# EAGLE design 上昇＆摘果機構回路 (EAGLE 9.6.2)
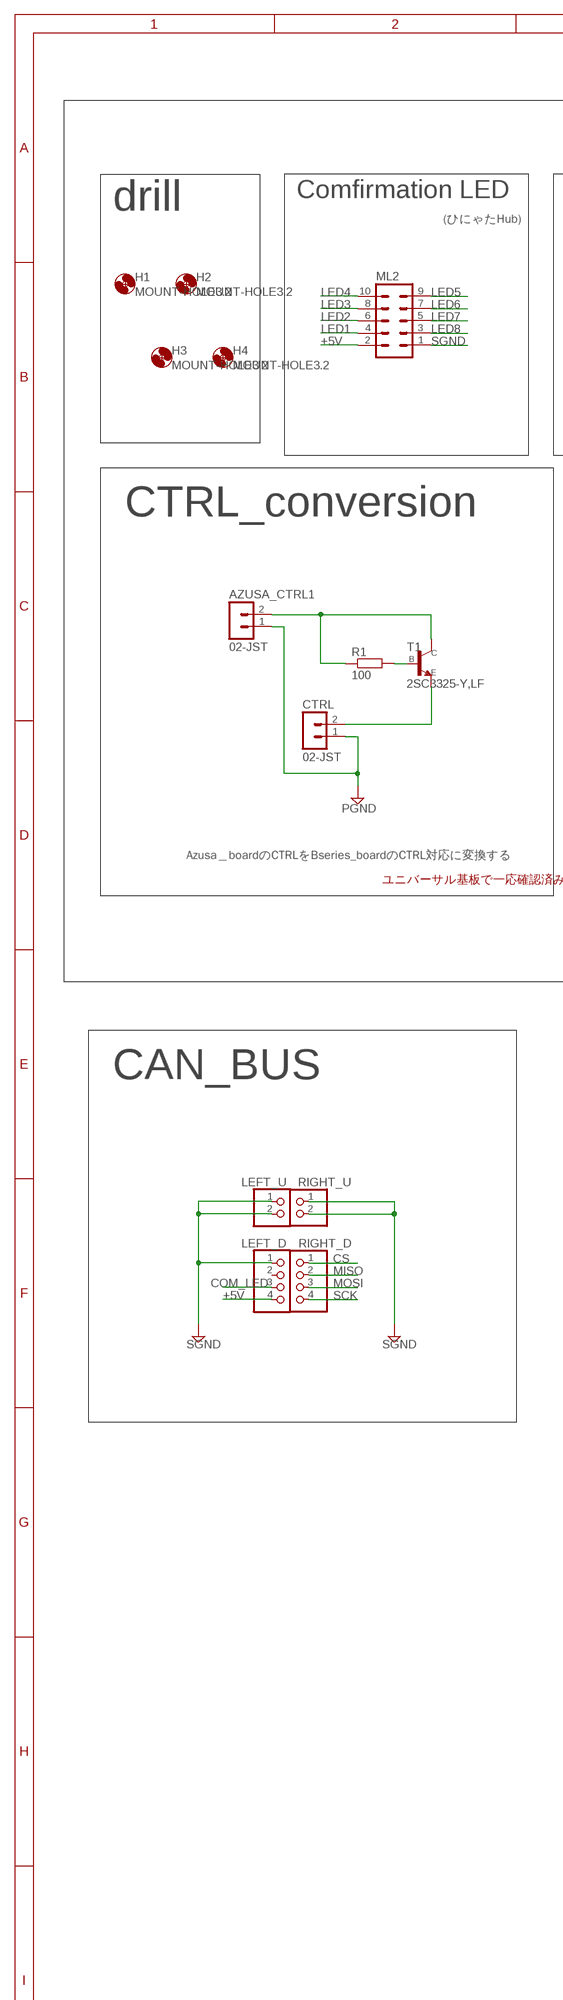
[diagram p0: schematic, sheet 1, part 1 of 2]
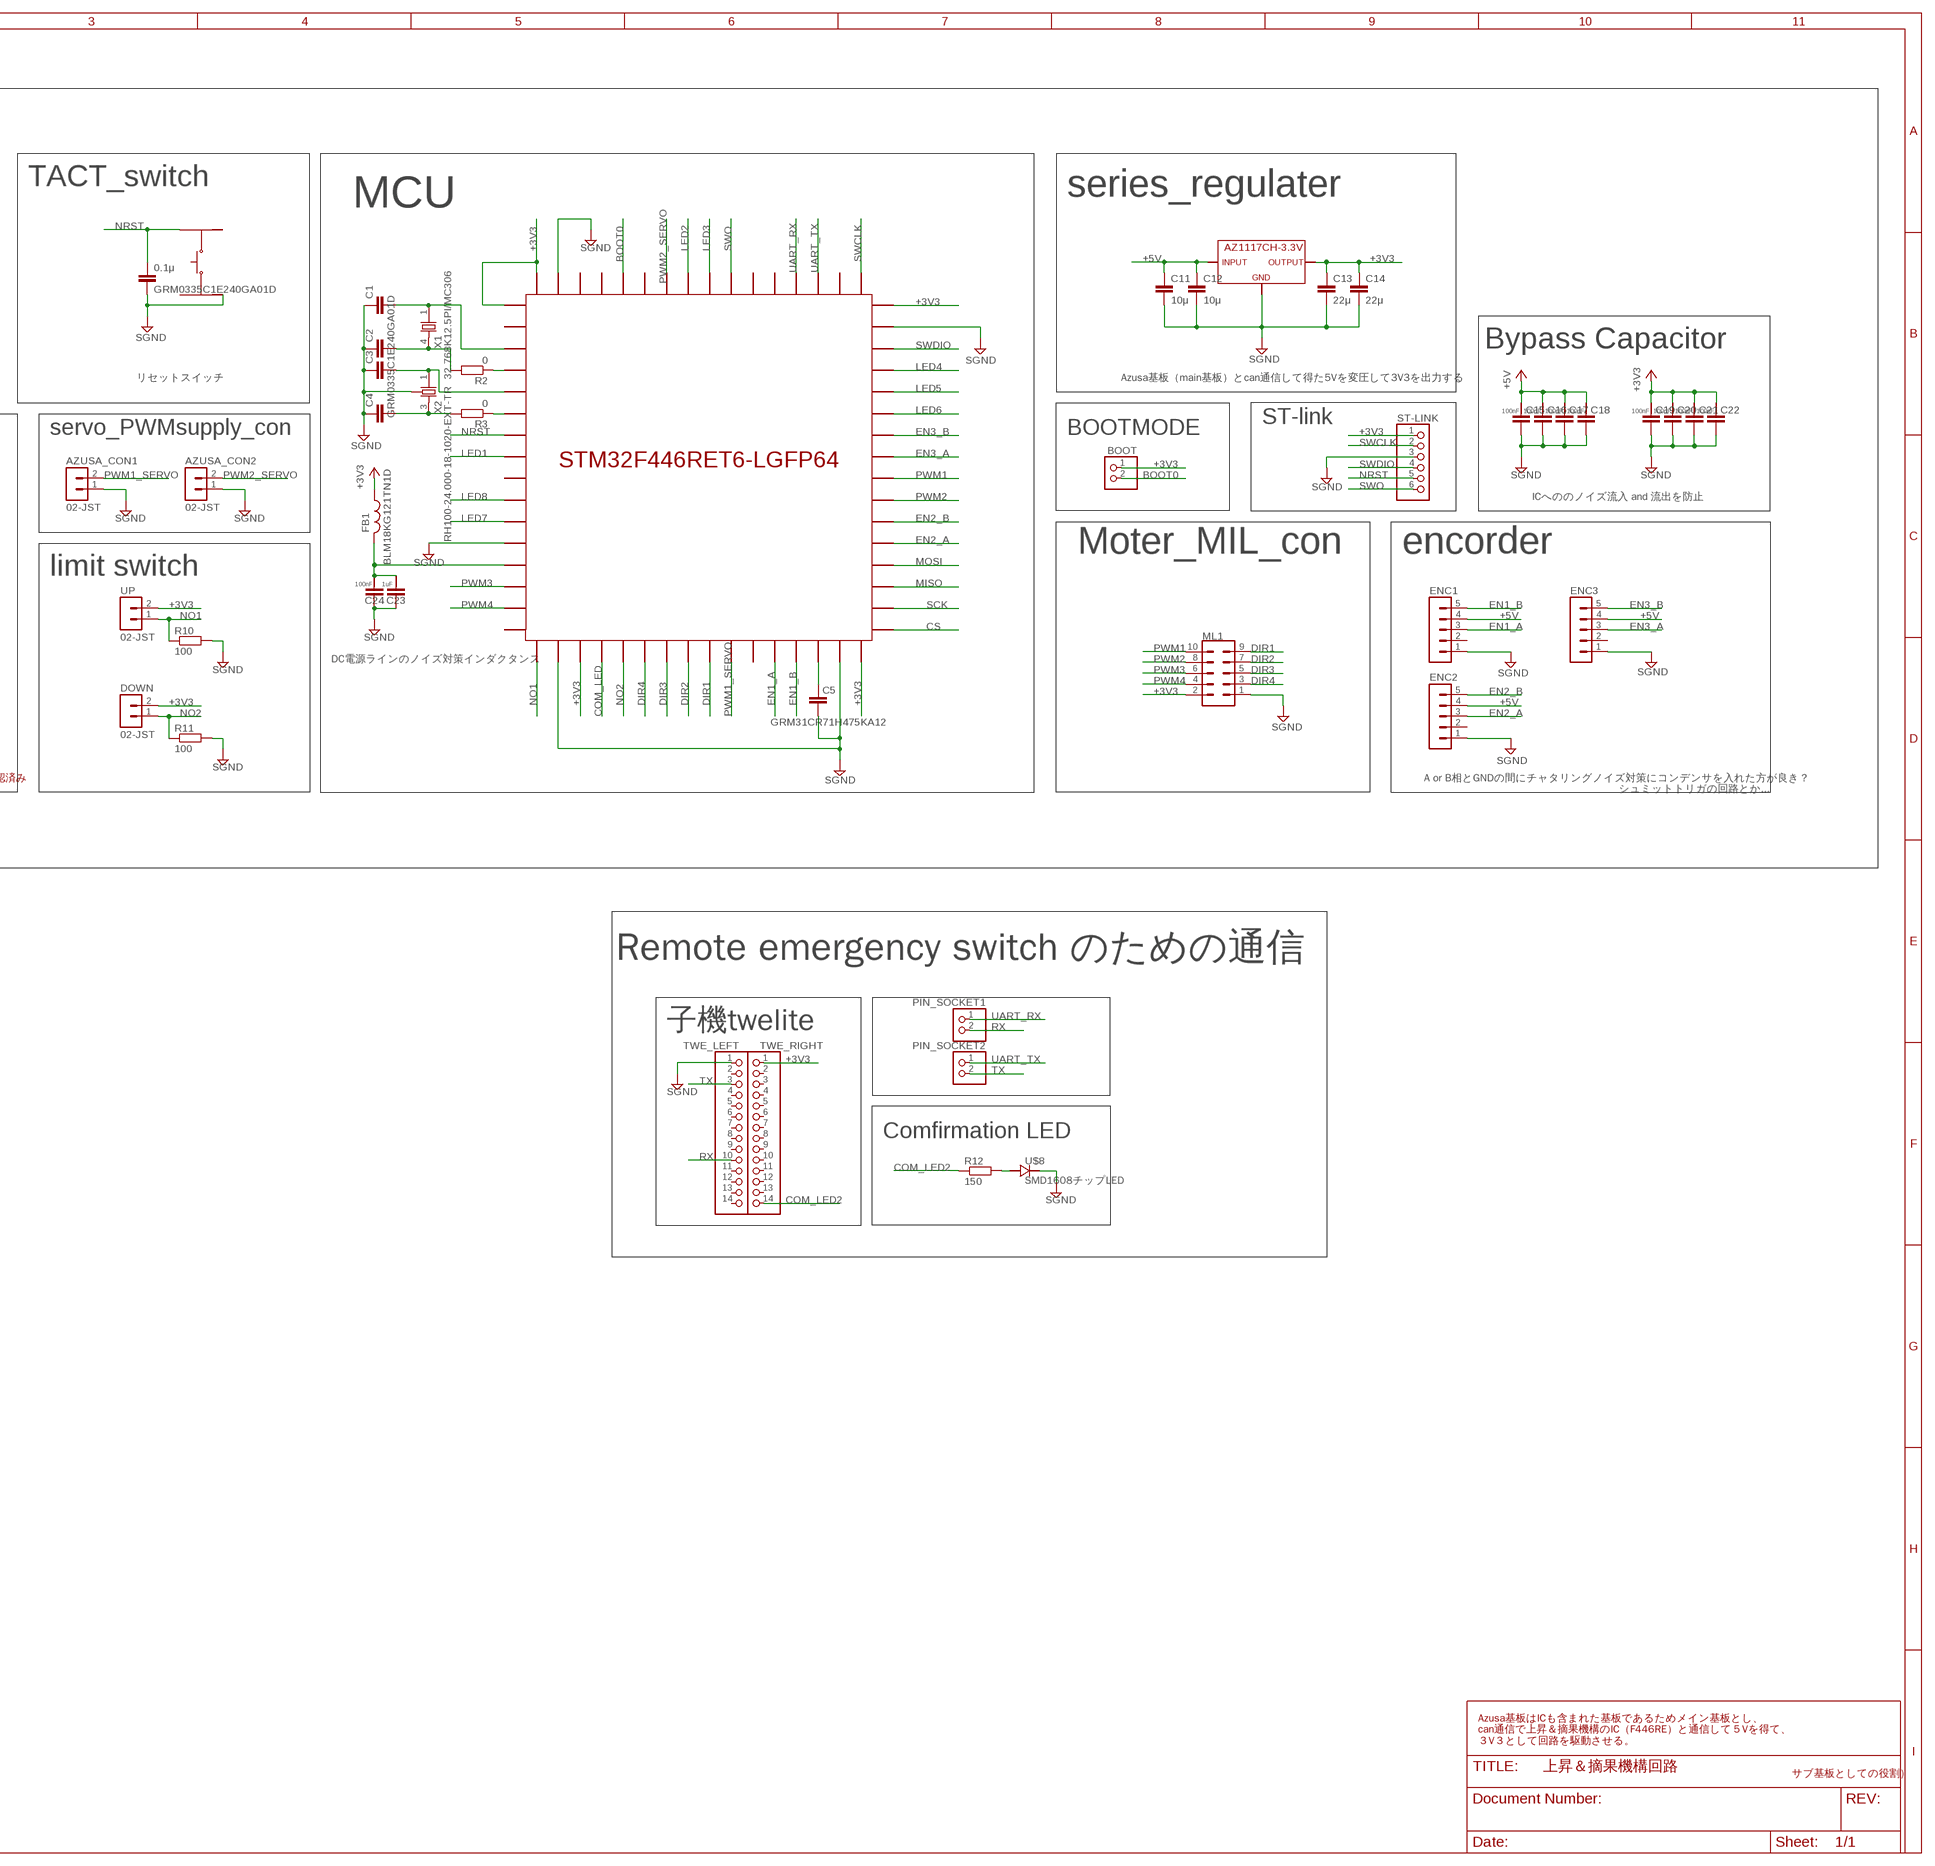
[diagram p1: schematic, sheet 1, part 2 of 2]

## Parts
0.1μ  GRM0335C1E240GA01D  [GRM0335C1E240GA01D]
AZUSA_CON1  02-JST  [B2B-XH]
AZUSA_CON2  02-JST  [B2B-XH]
AZUSA_CTRL1  02-JST  [B2B-XH]
BOOT  PINHD-1X2  [1X02]
C1  GRM0335C1E240GA01D  [GRM0335C1E240GA01D]
C2  GRM0335C1E240GA01D  [GRM0335C1E240GA01D]
C3  GRM0335C1E240GA01D  [GRM0335C1E240GA01D]
C4  GRM0335C1E240GA01D  [GRM0335C1E240GA01D]
C5  GRM31CR71H475KA12  [GRM31CR71H475KA12]
C11  10μ  GRM0335C1E240GA01D  [GRM0335C1E240GA01D]
C12  10μ  GRM0335C1E240GA01D  [GRM0335C1E240GA01D]
C13  22μ  GRM0335C1E240GA01D  [GRM0335C1E240GA01D]
C14  22μ  GRM0335C1E240GA01D  [GRM0335C1E240GA01D]
C15  GCM188L81H104KA57  [GCM188L81H104KA57]
C16  GCM188L81H104KA57  [GCM188L81H104KA57]
C17  GCM188L81H104KA57  [GCM188L81H104KA57]
C18  GCM188L81H104KA57  [GCM188L81H104KA57]
C19  GCM188L81H104KA57  [GCM188L81H104KA57]
C20  GCM188L81H104KA57  [GCM188L81H104KA57]
C21  GCM188L81H104KA57  [GCM188L81H104KA57]
C22  GCM188L81H104KA57  [GCM188L81H104KA57]
C23  GRM21BC72A105KE01  [GRM21BC72A105KE01]
C24  GCM188L81H104KA57  [GCM188L81H104KA57]
CTRL  02-JST  [B2B-XH]
DOWN  02-JST  [B2B-XH]
ENC1  05-JST  [B5B-XH]
ENC2  05-JST  [B5B-XH]
ENC3  05-JST  [B5B-XH]
FB1  BLM18KG121TN1D  [BLM18KG121TN1D]
H1  MOUNT-HOLE3.2  [3,2]
H2  MOUNT-HOLE3.2  [3,2]
H3  MOUNT-HOLE3.2  [3,2]
H4  MOUNT-HOLE3.2  [3,2]
LEFT_D  PINHD-1X4  [1X04]
LEFT_U  PINHD-1X2  [1X02]
ML1  ML10  [ML10]
ML2  ML10  [ML10]
PIN_SOCKET1  PINHD-1X2  [1X02]
PIN_SOCKET2  PINHD-1X2  [1X02]
R1  100  R-EU_M0805  [M0805]
R2  0  R-EU_M0805  [M0805]
R3  0  R-EU_M0805  [M0805]
R10  100  R-EU_M0805  [M0805]
R11  100  R-EU_M0805  [M0805]
R12  150  R-EU_M0805  [M0805]
REGYURETA  ３．３V  ＡＺ１１１７ＣＨ－３．３ＴＲＧ１  [ＡＺ１１１７ＣＨ－３．３ＴＲＧ１]
RIGHT_D  PINHD-1X4  [1X04]
RIGHT_U  PINHD-1X2  [1X02]
ST-LINK  PINHD-1X6  [1X06]
T1  2SC3325-Y,LF  [2SC3325-Y,LF]
TWE_LEFT  PINHD-1X14  [1X14]
TWE_RIGHT  PINHD-1X14  [1X14]
U$1  STM32F446RET6-LGRF64  [STM32F446FRT6]
U$2  TACTSWITCH  [TACTSWITCH]
U$8  SMD1608チップLED  [SMD1608チップLED]
UP  02-JST  [B2B-XH]
X1  32.768K12.5PI/MC306  [32.768K12.5PI/MC306]
X2  RH100-24.000-18-1020-EXT-TR  [RH100-24.000-18-1020-EXT-TR]

## Nets
+3V3: BOOT.1 C13.1 C14.1 C19.P$1 C20.P$1 C21.P$1 C22.P$1 DOWN.2 FB1.1 ML1.2 REGYURETA.OUTPUT REGYURETA.VOUT(OUTPUT) ST-LINK.1 TWE_RIGHT.1 U$1.VBAT U$1.VDD1 U$1.VDD2 U$1.VDD3 U$1.VDD4 UP.2
+5V: C11.1 C12.1 C15.P$1 C16.P$1 C17.P$1 C18.P$1 ENC1.4 ENC2.4 ENC3.4 LEFT_D.4 ML2.2 REGYURETA.INPUT
BOOT0: BOOT.2 U$1.BOOT0
COM_LED: LEFT_D.3 U$1.PA4
COM_LED2: R12.1 TWE_RIGHT.14
CS: RIGHT_D.1 U$1.PB12
DIR1: ML1.9 U$1.PC5
DIR2: ML1.7 U$1.PC4
DIR3: ML1.5 U$1.PA7
DIR4: ML1.3 U$1.PA6
EN1_A: ENC1.3 U$1.PB2
EN1_B: ENC1.5 U$1.PB10
EN2_A: ENC2.3 U$1.PC6
EN2_B: ENC2.5 U$1.PC7
EN3_A: ENC3.3 U$1.PA8
EN3_B: ENC3.5 U$1.PA9
LED1: ML2.4 U$1.PC0
LED2: ML2.6 U$1.PB5
LED3: ML2.8 U$1.PB4
LED4: ML2.10 U$1.PA12
LED5: ML2.9 U$1.PA11
LED6: ML2.7 U$1.PA10
LED7: ML2.5 U$1.PC3
LED8: ML2.3 U$1.PC2
MISO: RIGHT_D.2 U$1.PB14
MOSI: RIGHT_D.3 U$1.PB15
N$1: C2.2 R2.2 X1.4
N$2: C5.1 U$1.VCAP_1
N$3: C1.2 U$1.PC14-OSC32_IN X1.1
N$4: C3.2 U$1.PH0-OSC_IN X2.1
N$5: C4.2 R3.2 X2.3
N$6: R3.1 U$1.PH1-OSC_OUT
N$7: R2.1 U$1.PC15-OSC32_OUT
N$8: CTRL.2 T1.EMITTER(E)
N$9: AZUSA_CTRL1.2 R1.1 T1.COLLECTOR(C)
N$10: R1.2 T1.BASE(B)
N$19: R12.2 U$8.ANODE
N$46: C23.P$1 C24.P$1 FB1.2 U$1.VDDA/VREF+
NO1: R10.1 U$1.PA3 UP.1
NO2: DOWN.1 R11.1 U$1.PA5
NRST: 0.1μ.1 ST-LINK.5 U$1.NRST U$2.P$1
PGND: AZUSA_CTRL1.1 CTRL.1 ; supply symbol labelled GND
PWM1: ML1.10 U$1.PC9
PWM1_SERVO: AZUSA_CON1.2 U$1.PB0
PWM2: ML1.8 U$1.PC8
PWM2_SERVO: AZUSA_CON2.2 U$1.PB6
PWM3: ML1.6 U$1.PA0
PWM4: ML1.4 U$1.PA1
RX: PIN_SOCKET1.2 TWE_LEFT.10
SCK: RIGHT_D.4 U$1.PB13
SGND: 0.1μ.2 AZUSA_CON1.1 AZUSA_CON2.1 C1.1 C2.1 C3.1 C4.1 C5.2 C11.2 C12.2 C13.2 C14.2 C15.P$2 C16.P$2 C17.P$2 C18.P$2 C19.P$2 C20.P$2 C21.P$2 C22.P$2 C23.P$2 C24.P$2 ENC1.1 ENC2.1 ENC3.1 LEFT_D.1 LEFT_U.1 LEFT_U.2 ML1.1 ML2.1 R10.2 R11.2 REGYURETA.ADJ/GND(GND) RIGHT_U.1 RIGHT_U.2 ST-LINK.3 TWE_LEFT.1 U$1.VSS1 U$1.VSS2 U$1.VSS3 U$1.VSS4 U$1.VSSA/VREF- U$2.P$4 U$8.CATHODE X2.2(SHIELD) X2.4(SHIELD) ; supply symbol labelled GND
SWCLK: ST-LINK.2 U$1.PA14
SWDIO: ST-LINK.4 U$1.PA13
SWO: ST-LINK.6 U$1.PB3
TX: PIN_SOCKET2.2 TWE_LEFT.3
UART_RX: PIN_SOCKET1.1 U$1.PC11
UART_TX: PIN_SOCKET2.1 U$1.PC10
Unconnected: ENC1.2 ENC2.2 ENC3.2 LEFT_D.2 TWE_LEFT.2 TWE_LEFT.4 TWE_LEFT.5 TWE_LEFT.6 TWE_LEFT.7 TWE_LEFT.8 TWE_LEFT.9 TWE_LEFT.11 TWE_LEFT.12 TWE_LEFT.13 TWE_LEFT.14 TWE_RIGHT.2 TWE_RIGHT.3 TWE_RIGHT.4 TWE_RIGHT.5 TWE_RIGHT.6 TWE_RIGHT.7 TWE_RIGHT.8 TWE_RIGHT.9 TWE_RIGHT.10 TWE_RIGHT.11 TWE_RIGHT.12 TWE_RIGHT.13 U$1.PA2 U$1.PA15 U$1.PB1 U$1.PB7 U$1.PB8 U$1.PB9 U$1.PC1 U$1.PC12 U$1.PC13 U$1.PD2 U$2.P$2 U$2.P$3

## Notes on the sheet
- Comfirmation LED
- drill | TACT_switch
- (ひにゃたHub) | series_regulater
- MCU
- Bypass Capacitor
- リセットスイッチ | Azusa基板（main基板）とcan通信して得た5Vを変圧して3V3を出力する
- ST-link
- servo_PWMsupply_con | BOOTMODE
- CTRL_conversion
- ICへののノイズ流入 and 流出を防止
- Moter_MIL_con | encorder
- limit switch
- DC電源ラインのノイズ対策インダクタンス
- C5
- Azusa＿boardのCTRLをBseries_boardのCTRL対応に変換する
- ユニバーサル基板で一応確認済み | A or B相とGNDの間にチャタリングノイズ対策にコンデンサを入れた方が良き？
- シュミットトリガの回路とか...
- Remote emergency switch のための通信
- CAN_BUS
- 子機twelite
- Comfirmation LED
- Azusa基板はICも含まれた基板であるためメイン基板とし、
  can通信で上昇＆摘果機構のIC（F446RE）と通信して５Vを得て、
  ３V３として回路を駆動させる。
- サブ基板としての役割）

## Library data of the parts
0.1μ C1-C4 C11-C14 = GRM0335C1E240GA01D:GRM0335C1E240GA01D
AZUSA_CON1 AZUSA_CON2 AZUSA_CTRL1 CTRL DOWN UP = con-jst-xh (1):02-JST: JST CONNECTOR
BOOT LEFT_U PIN_SOCKET1 PIN_SOCKET2 RIGHT_U = pinhead:PINHD-1X2: PIN HEADER
C5 = GRM31CR71H475KA12:GRM31CR71H475KA12
C15-C22 C24 = GCM188L81H104K57(0.1uF):GCM188L81H104KA57
C23 = GRM21BC72A105KE01(1uF):GRM21BC72A105KE01
ENC1-ENC3 = con-jst-xh (1):05-JST: JST CONNECTOR
FB1 = BLM18KG121TN1D:BLM18KG121TN1D
H1-H4 = holes:MOUNT-HOLE: MOUNTING HOLE with drill center marker
LEFT_D RIGHT_D = pinhead:PINHD-1X4: PIN HEADER
ML1 ML2 = con-ml:ML10: HARTING; OC_FARNELL: unknown; OC_NEWARK: unknown
R1-R3 R10-R12 = rcl:R-EU_: RESISTOR, European symbol; SPICEPREFIX: R
REGYURETA = AZ1117CH-3.3TRG1:ＡＺ１１１７ＣＨ－３．３ＴＲＧ１
ST-LINK = pinhead:PINHD-1X6: PIN HEADER
T1 = 2SC3325-Y,LF:2SC3325-Y,LF
TWE_LEFT TWE_RIGHT = pinhead:PINHD-1X14: PIN HEADER
U$1 = STM32F446FRT6-LGFP64:STM32F446RET6-LGRF64
U$2 = TACTSWITCH (CS11027.0F100):TACTSWITCH
U$8 = SMD1608チップLED:SMD1608チップLED
X1 = (resonator):32.768K12.5PI/MC306
X2 = RH100-24.000-18-1020-EXT-TR:RH100-24.000-18-1020-EXT-TR

## Board
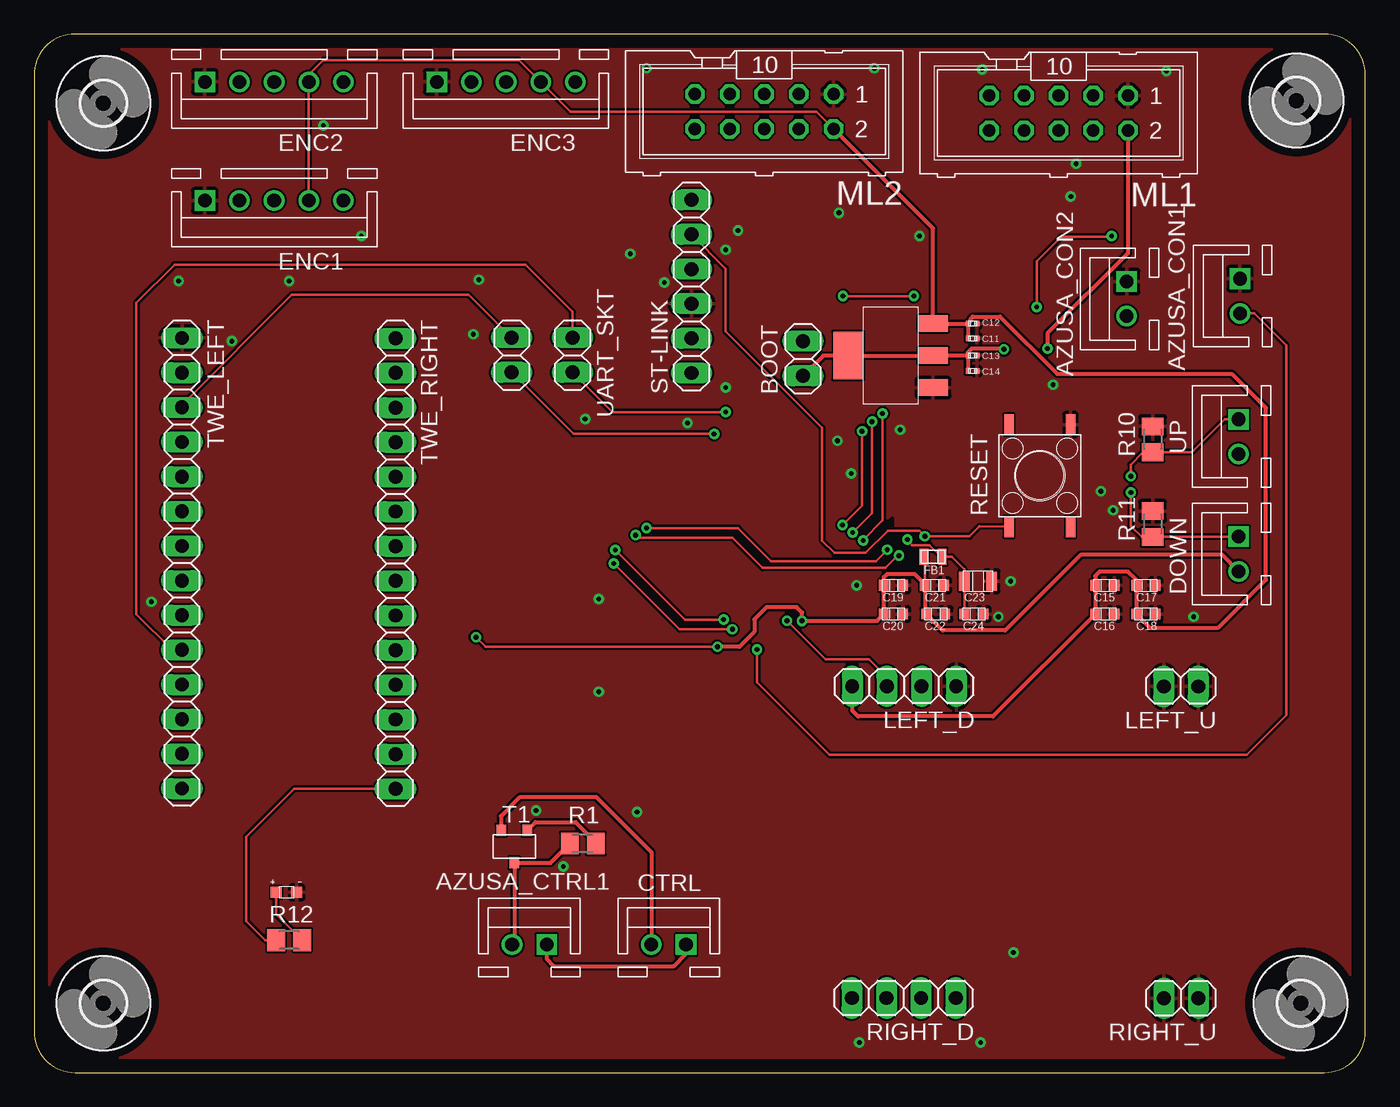
[diagram p2: board, top side]
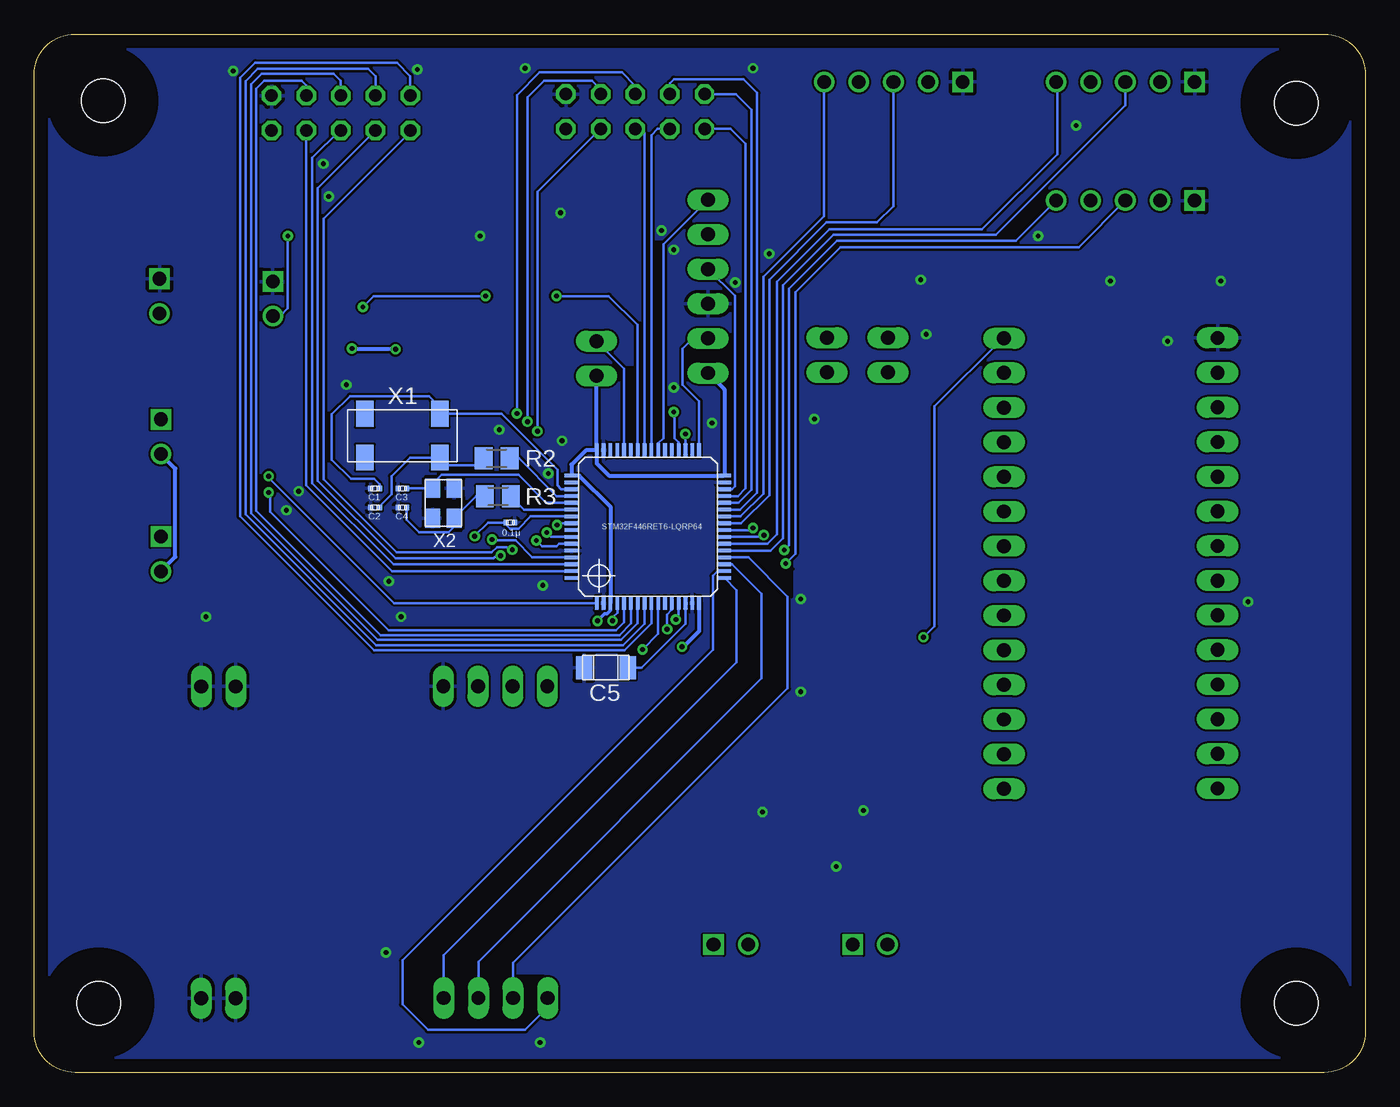
[diagram p3: board, bottom side, seen from below]

Size 97.6 x 76.1 mm. Coordinates in mm from the lower left corner, seen from the top.
Outline: 0,73.1 0,3 arc90 3,0 94.6,0 arc90 97.6,3 97.6,73.1 arc90 94.6,76.1 3,76.1 arc90 0,73.1
Copper layers (1*16): Top 0.035mm / dielectric 1.5mm / Bottom 0.035mm
Design rules "default": minimum track width 6mil, minimum drill 0.35mm, track to track 6mil, track to pad 6mil, pad to pad 6mil, via to via 6mil, smd to smd 6mil, copper to edge 40mil, drill to drill 6mil, minimum pad ring 10mil, minimum via ring 8mil, stop-mask expansion 4mil, vias tented up to drill 0mil, thermal gap 10mil

### Footprints (pad centres in the part's own frame; a part is rotated, then mirrored left to right if it is on the bottom)
GRM0335C1E240GA01D = smd 0.35 x 0.4: 1 -0.325,0; 2 0.325,0
B2B-XH = drill 1 square: 1 1.27,0 | drill 1: 2 -1.27,0
1X02 = drill 1.016 long: 1 -1.27,0; 2 1.27,0
GRM31CR71H475KA12 = smd 1.2 x 1.7: 1 -1.6,0; 2 1.6,0
GCM188L81H104KA57 = smd 0.7 x 0.8: P$1 -0.7,0; P$2 0.7,0
GRM21BC72A105KE01 = smd 0.8 x 1.4: P$1 -1,0; P$2 1,0
B5B-XH = drill 1 square: 1 5.08,0 | drill 1: 2 2.54,0; 3 0,0; 4 -2.54,0; 5 -5.08,0
BLM18KG121TN1D = smd 0.65 x 1.2: 1 -0.675,0; 2 0.675,0
3,2 = hole 3.2: 0,0
1X04 = drill 1.016 long: 1 -3.81,0; 2 -1.27,0; 3 1.27,0; 4 3.81,0
ML10 = drill 0.914 octagon: 1 -5.08,-1.27; 2 -5.08,1.27; 3 -2.54,-1.27; 4 -2.54,1.27; 5 0,-1.27; 6 0,1.27; 7 2.54,-1.27; 8 2.54,1.27; 9 5.08,-1.27; 10 5.08,1.27
M0805 = smd 1.3 x 1.6: 1 -0.95,0; 2 0.95,0
ＡＺ１１１７ＣＨ－３．３ＴＲＧ１ = smd 1.2 x 2.2: ADJ/GND -2.35,-3.1; INPUT 2.35,-3.1; OUTPUT 0,-3.1 | smd 3.5 x 2.2: VOUT 0,3.1
1X06 = drill 1.016 long: 1 -6.35,0; 2 -3.81,0; 3 -1.27,0; 4 1.27,0; 5 3.81,0; 6 6.35,0
2SC3325-Y,LF = smd 0.825 x 0.7: BASE -1.188,0.95; COLLECTOR 1.188,0; EMITTER -1.188,-0.95
1X14 = drill 1.016 long: 1 -16.51,0; 2 -13.97,0; 3 -11.43,0; 4 -8.89,0; 5 -6.35,0; 6 -3.81,0; 7 -1.27,0; 8 1.27,0; 9 3.81,0; 10 6.35,0; 11 8.89,0; 12 11.43,0; 13 13.97,0; 14 16.51,0
STM32F446FRT6 = smd 0.27 x 1: BOOT0 -1.75,5.6; PA3 -3.75,-5.6; PA4 -2.25,-5.6; PA5 -1.75,-5.6; PA6 -1.25,-5.6; PA7 -0.75,-5.6; PA14 3.75,5.6; PA15 3.25,5.6; PB0 0.75,-5.6; PB1 1.25,-5.6; PB2 1.75,-5.6; PB3 0.75,5.6; PB4 0.25,5.6; PB5 -0.25,5.6; PB6 -0.75,5.6; PB7 -1.25,5.6; PB8 -2.25,5.6; PB9 -2.75,5.6; PB10 2.25,-5.6; PC4 -0.25,-5.6; PC5 0.25,-5.6; PC10 2.75,5.6; PC11 2.25,5.6; PC12 1.75,5.6; PD2 1.25,5.6; VCAP_1 2.75,-5.6; VDD1 -2.75,-5.6; VDD2 3.75,-5.6; VDD4 -3.75,5.6; VSS1 -3.25,-5.6; VSS2 3.25,-5.6; VSS4 -3.25,5.6 | smd 1 x 0.27: NRST -5.6,0.75; PA0 -5.6,-2.75; PA1 -5.6,-3.25; PA2 -5.6,-3.75; PA8 5.6,0.25; PA9 5.6,0.75; PA10 5.6,1.25; PA11 5.6,1.75; PA12 5.6,2.25; PA13 5.6,2.75; PB12 5.6,-3.75; PB13 5.6,-3.25; PB14 5.6,-2.75; PB15 5.6,-2.25; PC0 -5.6,0.25; PC1 -5.6,-0.25; PC2 -5.6,-0.75; PC3 -5.6,-1.25; PC6 5.6,-1.75; PC7 5.6,-1.25; PC8 5.6,-0.75; PC9 5.6,-0.25; PC13 -5.6,3.25; PC14-OSC32_IN -5.6,2.75; PC15-OSC32_OUT -5.6,2.25; PH0-OSC_IN -5.6,1.75; PH1-OSC_OUT -5.6,1.25; VBAT -5.6,3.75; VDD3 5.6,3.75; VDDA/VREF+ -5.6,-2.25; VSS3 5.6,3.25; VSSA/VREF- -5.6,-1.75
TACTSWITCH = smd 1.5 x 0.7: P$1 -3.75,2.25; P$2 -3.75,-2.25; P$3 3.75,2.25; P$4 3.75,-2.25
SMD1608チップLED = smd 0.8 x 0.8: ANODE -0.75,0; CATHODE 0.75,0
32.768K12.5PI/MC306 = smd 1.3 x 1.9: 1 -2.75,-1.6; 2 2.75,-1.6; 3 2.75,1.6; 4 -2.75,1.6
RH100-24.000-18-1020-EXT-TR = smd 1.4 x 1.1: 1 -1.1,-0.8; 2 1.1,-0.8; 3 1.1,0.8; 4 -1.1,0.8

### Placement (x,y rotation side)
0.1μ  62.7,40.3 0 bottom
AZUSA_CON1  88.4,56.9 90 top
AZUSA_CON2  80.1,56.7 90 top
AZUSA_CTRL1  36.31,9.37 0 top
BOOT  56.37,52.32 90 top
C1  72.6,42.8 0 bottom
C2  72.6,41.4 0 bottom
C3  70.6,42.8 0 bottom
C4  70.6,41.4 0 bottom
C5  55.68,29.67 180 bottom
C11  68.8,53.8 0 top
C12  68.8,54.89 0 top
C13  68.8,52.55 0 top
C14  68.8,51.4 0 top
C15  78.5,35.7 0 top
C16  78.5,33.6 0 top
C17  81.5,35.7 0 top
C18  81.5,33.6 0 top
C19  63,35.7 0 top
C20  63,33.6 0 top
C21  66,35.7 0 top
C22  66.1,33.6 0 top
C23  69.2,36 0 top
C24  68.9,33.6 0 top
CTRL  46.52,9.37 0 top
DOWN  88.3,38 90 top
ENC1  17.6,63.9 180 top
ENC2  17.6,72.6 180 top
ENC3  34.6,72.6 180 top
FB1  65.9,37.8 0 top
H1  92.85,5.08 0 top
H2  5.08,5.08 0 top
H3  92.55,71.23 0 top
H4  5.08,71.03 0 top
LEFT_D  63.79,28.32 180 top
LEFT_U  84.08,28.29 180 top
ML1  75.11,70.32 180 top
ML2  53.53,70.43 180 top
PIN_SOCKET1  39.48,52.58 90 top
PIN_SOCKET2  35.01,52.58 90 top
R1  40.22,16.78 0 top
R2  63.7,45.02 180 bottom
R3  63.6,42.23 180 bottom
R10  82,46.4 90 top
R11  82,40.2 90 top
R12  18.7,9.7 0 top
REGYURETA  62.8,52.54 90 top
RIGHT_D  63.76,5.46 180 top
RIGHT_U  84.09,5.44 180 top
ST-LINK  48.2,57.61 90 top
T1  35.2,16.56 270 top
TWE_LEFT  10.84,37.32 270 top
TWE_RIGHT  26.49,37.3 270 top
U$1  52.6,40 0 bottom
U$2  73.73,43.74 90 top
U$8  18.5,13.2 0 top
UP  88.3,46.6 90 top
X1  70.6,46.67 180 bottom
X2  67.6,41.73 270 bottom

### Tracks (layer width: path | path; a pad name or v marks a point on that pad's centre or on a via)
+3V3  (via drill 0.35)
  Top 0.2: v50.1,31.2 33.1,31.2 v32.4,31.9 | FB1.1 65.3,37.73 C21.P$1
  Top 0.3: BOOT.1 57.85,52.54 REGYURETA.VOUT REGYURETA.OUTPUT C13.1 | v74.29,53.06 74.29,54.16 80.19,60.06 ML1.2 | C13.1 68.45,52.58 68.45,52.77 68.72,53.05 71.05,53.05 v71.1,53 | C13.1 C14.1 | DOWN.2 87.1,37.93 76.73,37.93 71.2,32.4 66.6,32.4 C22.P$1 65.3,33.7 C21.P$1 65.3,35.8 64.55,36.55 62.54,36.55 62.3,36.31 C19.P$1 C20.P$1 61.8,33.1 v56.3,33.1 56.3,33.7 55.9,34.1 53.7,34.1 52.8,33.2 52.8,32.3 51.7,31.2 v50.1,31.2
  Bottom 0.2: TWE_RIGHT.1 26.59,53.81 31.59,48.81 31.59,32.71 v32.4,31.9
  Bottom 0.25: v56.3,33.1 55.78,33.62 55.6,33.62 55.35,33.87 U$1.VDD1
  Bottom 0.3: ST-LINK.1 47,50.06 U$1.VDD3 55.46,43.75 56.35,44.64 U$1.VDD4 | DOWN.2 87.24,37.79 87.24,44.25 88.3,45.31 UP.2 | U$1.VDD2 48.85,32.35 50,31.2 v50.1,31.2 | U$1.VDD4 56.35,51.04 BOOT.1 | U$1.VDD4 57.15,45.6 58.2,44.55 U$1.VBAT 57.64,43.75 55.35,41.46 U$1.VDD1 | v71.1,53 74.23,53 v74.29,53.06
+5V
  Top 0.2: ENC1.4 20.14,72.4 ENC2.4 20.14,73.14 21.2,74.2 35.54,74.2 ENC3.4 39.32,70.42 57.35,70.42 ML2.2
  Top 0.3: ML2.2 65.9,61.87 REGYURETA.INPUT C12.1 | C12.1 C11.1 | LEFT_D.4 59.98,26.52 60.4,26.1 70.3,26.1 C16.P$1 C15.P$1 77.8,36.4 78.1,36.7 80.2,36.7 80.8,36.1 C17.P$1 C18.P$1 81.8,32.6 86.8,32.6 90.3,36.1 90.3,48.7 87.8,51.2 75,51.2 70.81,55.39 68.82,55.39 68.65,55.22 68.65,55.06 C12.1
BOOT0
  Bottom 0.2: U$1.BOOT0 54.35,51.56 56.37,53.57 BOOT.2
COM_LED  (via drill 0.35)
  Top 0.2: LEFT_D.3 62.52,28.97 61.2,30.29 58,30.29 v55.19,33.1
  Bottom 0.2: U$1.PA4 54.85,33.71 55.19,33.37 v55.19,33.1
COM_LED2
  Top 0.2: TWE_RIGHT.14 19.05,20.79 15.55,17.29 15.55,11.1 16.95,9.7 R12.1
CS
  Bottom 0.2: U$1.PB12 46.1,35.35 46.1,30.05 67.57,8.58 RIGHT_D.1
DIR1
  Bottom 0.2: ML1.9 70.03,73.03 71,74 81.39,74 82.5,72.89 82.5,40.76 72.68,30.94 54.32,30.94 52.35,32.91 U$1.PC5
DIR2
  Bottom 0.2: ML1.7 72.57,73.01 73.13,73.57 81.19,73.57 82.1,72.66 82.1,40.9 72.52,31.32 54.43,31.32 52.85,32.91 U$1.PC4
DIR3
  Bottom 0.2: ML1.5 75.11,72.69 75.62,73.2 80.93,73.2 81.7,72.43 81.7,41 72.4,31.7 54.55,31.7 53.35,32.91 U$1.PA7
DIR4
  Bottom 0.2: ML1.3 77.65,72.35 78,72.7 80.72,72.7 81.31,72.11 81.31,41.17 72.2,32.06 54.7,32.06 53.85,32.91 U$1.PA6
EN1_A  (via drill 0.35)
  Top 0.2: v51.19,32.48 v51.18,32.47 47.33,32.47 v42.5,37.3
  Bottom 0.2: v42.5,37.3 41.8,38.01 41.8,57.2 38.49,60.5 21.02,60.5 17.62,63.9 ENC1.3 | U$1.PB2 50.85,33.91 51.2,33.56 v51.2,32.49 v51.19,32.48
EN1_B  (via drill 0.35)
  Top 0.2: v50.55,33.2 50.54,33.19 47.71,33.19 v42.6,38.3
  Bottom 0.2: v42.6,38.3 42.25,38.65 42.25,57.45 38.76,60.94 25.63,60.94 ENC1.5 | U$1.PB10 50.35,33.4 v50.55,33.2
EN2_A
  Bottom 0.2: ENC2.3 17.6,70.9 27.11,61.4 39.01,61.4 42.7,57.7 42.7,39.17 43.62,38.25 U$1.PC6
EN2_B
  Bottom 0.2: ENC2.5 22.6,72.52 22.6,67.3 28.1,61.8 39.3,61.8 43.15,57.95 43.15,39.44 43.84,38.75 U$1.PC7
EN3_A
  Bottom 0.2: ENC3.3 34.6,63.5 35.8,62.3 39.5,62.3 43.7,58.1 43.7,42.32 45.77,40.25 U$1.PA8
EN3_B
  Bottom 0.2: ENC3.5 39.68,62.77 44.13,58.32 44.13,42.41 45.8,40.75 U$1.PA9
LED1  (via drill 0.35)
  Top 0.2: v59.27,40.12 60.7,41.55 v60.7,47
  Bottom 0.2: U$1.PC0 59.13,40.25 v59.27,40.12 | v60.7,47 60.7,64.53 ML2.4
LED2
  Bottom 0.2: ML2.6 53.13,69.16 52.85,68.88 U$1.PB5
LED3
  Bottom 0.2: U$1.PB4 52.35,68.7 51.89,69.16 ML2.8
LED4
  Bottom 0.2: ML2.10 46.55,69.16 45.45,68.06 45.45,42.81 46.01,42.25 U$1.PA12
LED5
  Bottom 0.2: U$1.PA11 45.95,41.75 45,42.7 45,70.55 46.15,71.7 ML2.9
LED6
  Bottom 0.2: U$1.PA10 45.85,41.25 44.6,42.5 44.6,71.8 45.6,72.8 50.69,72.8 50.99,72.5 ML2.7
LED7  (via drill 0.35)
  Top 0.2: v62.2,48.3 62.2,40.48 60.79,39.06 v60.79,38.98
  Bottom 0.2: ML2.5 53.53,72.33 54.51,73.31 60.53,73.31 62.2,71.63 v62.2,48.3 | U$1.PC3 59.1,38.75 59.3,38.55 60.35,38.55 v60.79,38.98
LED8  (via drill 0.35)
  Top 0.2: v60.01,39.57 61.43,40.99 v61.43,47.7
  Bottom 0.2: ML2.3 56.07,72.07 56.7,72.7 60.2,72.7 61.43,71.47 v61.43,47.7 | U$1.PC2 59.69,39.25 v60.01,39.57
MISO
  Bottom 0.2: U$1.PB14 46.45,37.25 44.27,35.08 44.27,28.89 65.03,8.13 RIGHT_D.2
MOSI
  Bottom 0.2: U$1.PB15 45.25,37.75 42.37,34.88 42.37,28.16 62.49,8.03 RIGHT_D.3
N$1
  Bottom 0.2: R2.2 65.16,44.52 67.29,44.52 X1.4 70.03,45.07 71.4,43.7 71.4,42.38 72.27,41.5 C2.2
N$2
  Bottom 0.2: C5.1 53.08,29.67 49.85,32.9 U$1.VCAP_1
N$3
  Bottom 0.2: U$1.PC14-OSC32_IN | U$1.PC14-OSC32_IN 58.96,42.75 59.23,43.02 59.23,44.17 63.33,48.27 X1.1 67.85,48.77 68.65,49.57 74.45,49.57 75.77,48.24 75.77,44.9 74.38,43.5 72.67,43.5 72.27,43.1 C1.2
N$4
  Bottom 0.2: U$1.PH0-OSC_IN 60.05,41.75 62.1,43.8 67.73,43.8 68.4,43.13 X2.1 70.24,42.83 C3.2
N$5
  Bottom 0.2: R3.2 65.2,42.23 X2.3 66.8,40 67.2,39.6 69.38,39.6 70.27,40.5 C4.2
N$6
  Bottom 0.2: U$1.PH1-OSC_OUT 61.67,41.25 R3.1
N$7
  Bottom 0.2: U$1.PC15-OSC32_OUT 59.28,42.25 62.05,45.02 R2.1
N$8
  Top 0.3: T1.EMITTER 34.22,17.78 34.22,18.78 35.64,20.2 41.2,20.2 45.25,16.15 CTRL.2
N$9
  Top 0.2: T1.COLLECTOR 35.22,15.35
  Top 0.3: 35.22,15.35 35.22,9.55 AZUSA_CTRL1.2 | T1.COLLECTOR 37.86,15.37 R1.1
N$10
  Top 0.3: T1.BASE 36.75,18.35 39.7,18.35 41.17,16.88 R1.2
N$19
  Top 0.2: R12.2 17.75,11.6 U$8.ANODE
N$46  (via drill 0.35)
  Top 0.2: v64.02,39.06 64.02,38.98 64.35,38.65 65.66,38.65 66.51,37.8 FB1.2 67.27,37.8 68.2,36.88 C23.P$1 C24.P$1
  Bottom 0.2: U$1.VDDA/VREF+ 58.21,37.76 61.09,37.76 62.32,38.99 63.96,38.99 v64.02,39.06
NO1  (via drill 0.35)
  Top 0.2: UP.1 87.3,47.87 84.87,45.44 R10.1 81.3,45.45 80.4,44.55 v80.4,43.7
  Bottom 0.2: U$1.PA3 71.2,34.4 80.4,43.6 v80.4,43.7
NO2  (via drill 0.35)
  Top 0.2: DOWN.1 88.28,39.25 R11.1 81.2,39.25 80.4,40.05 v80.4,42.5
  Bottom 0.2: v80.4,42.5 80.3,42.4 80.3,41.1 71.61,32.41 54.95,32.41 54.35,33.02 U$1.PA5
NRST  (via drill 0.35)
  Top 0.2: ST-LINK.5 50.7,58.92 50.7,54.32 57.77,47.25 57.77,38.98 58.67,38.08 60.96,38.08 62.58,39.7 64.9,39.7 v65.3,39.3 68.57,39.3 69.29,40.02 U$2.P$1
  Bottom 0.2: U$1.NRST 61.19,40.75 62.1,39.85 62.7,39.85 63.02,40.17 0.1μ.1 64.32,40.3 65.3,39.33 v65.3,39.3
PGND
  Top 0.3: AZUSA_CTRL1.1 37.58,8.32 38.1,7.8 46.9,7.8 47.79,8.69 CTRL.1
PWM1  (via drill 0.35)
  Top 0.2: v44.9,39.9 51.61,39.9 54.03,37.48 61.71,37.48 v62.54,38.31
  Bottom 0.2: ML1.10 70.03,68.92 76.38,62.58 76.38,43.48 71.01,38.11 64.07,38.11 63.67,38.51 62.95,38.51 62.74,38.31 v62.54,38.31 | U$1.PC9 45.05,39.75 v44.9,39.9
PWM1_SERVO  (via drill 0.35)
  Top 0.2: v53,31 53,28.6 58.3,23.3 88.9,23.3 91.8,26.2 91.8,53.3 89.47,55.63 AZUSA_CON1.2
  Bottom 0.2: v53,31 51.85,32.15 U$1.PB0
PWM2  (via drill 0.35)
  Top 0.2: v44.1,39.38 44.3,39.18 51.2,39.18 53.4,36.98 62.4,36.98 63.3,37.88 v63.4,37.88
  Bottom 0.2: ML1.8 76.8,64.82 76.8,43.37 71.11,37.68 63.9,37.68 63.68,37.91 63.43,37.91 v63.4,37.88 | U$1.PC8 44.23,39.25 v44.1,39.38
PWM2_SERVO  (via drill 0.35)
  Top 0.2: v59.3,56.9 v64.5,56.9 | v73.5,56.1 73.5,59.46 75.3,61.26 79,61.26 v79,61.31
  Bottom 0.2: U$1.PB6 53.35,45.7 53.36,45.71 53.36,54.79 55.48,56.9 v59.3,56.9 | v64.5,56.9 72.7,56.9 v73.5,56.1 | AZUSA_CON2.2 79.57,55.43 79,56.01 v79,61.31
PWM3
  Bottom 0.2: ML1.6 75.18,69.05 77.2,67.03 77.2,43.2 71.25,37.25 U$1.PA0
PWM4
  Bottom 0.2: U$1.PA1 71.35,36.75 77.64,43.05 77.64,68.06 77.65,68.07 ML1.4
RX
  Top 0.2: PIN_SOCKET1.2 39.48,55.75 36.03,59.2 10.3,59.2 7.5,56.4 7.5,33.6 10.13,30.97 TWE_LEFT.10
SCK
  Bottom 0.2: RIGHT_D.4 59.95,4.76 61.6,3.12 68.72,3.12 70.6,5 70.6,8.21 47.85,30.97 47.85,36.4 47.49,36.75 U$1.PB13
SGND  (via drill 0.35)
  other vias: 64.9,61.3 74.7,50.4 21.2,69.4 76.4,66.6 76,64.2 59.9,43.91 44.9,73.6 24,61.3 44.2,19.1 36.8,19.2 38.8,15.1 46.2,57.9 50.7,50.2 51.6,61.7 50.7,60.3 63.5,47.1 78.2,42.6 71.6,36 18.7,58 14.5,53.6 10.6,58 47.9,47.6 40.4,47.9 32.2,54.1 61.6,73.6 83,73.4 43.7,60 70.7,33.4 69.5,73.5 32.6,58.1 41.4,27.9 41.4,34.7 71.8,8.8 60.5,2.2 69.4,2.2 8.6,34.5 85,33.4 59,63 60.3,35.7 58.9,46.3 79.1,41.2
  pour Top: 97.1,78.6 1.3,78.6 -3,74.3 -3,-0.8 0.9,-4.7 96.4,-4.7 102.4,1.3 102.4,73.3
  pour Bottom: 0.8,79.7 -4,74.9 -4,-0.6 -0.8,-3.8 4.8,-3.8 95.6,-3.8 101.9,2.5 101.9,73.1 95.3,79.7
  cutout Bottom: 66.4,41.9 67.3,41.9 67.5,42.1 67.6,42.2 67.6,43.5 67.8,43.7 68.9,43.7 69.1,43.5 69.1,41.7 68.9,41.5 67.9,41.5 67.8,41.5 67.6,41.3 67.6,39.9 67.4,39.7 66.3,39.7 66.1,39.9 66.1,41.6
  cutout Bottom: 51.7,60.8 52.1,60.8 52.1,60.4 51.7,60.4
  cutout Bottom: 45.8,57 46,56.8 46,56.4 45.7,56.4 45.7,57
  cutout Bottom: 42.1,36.9 42.1,34.9 42.6,35.4 42.6,36.6 42.3,36.9 42.2,36.9 42,36.9 42.1,36.8
  cutout Top: 62.9,40.6 62.9,39.8 62.5,39.8 62.5,40.2
  cutout Bottom: 60.2,7 62.1,7 61.7,6.6 60.7,6.6 60.3,7
  cutout Bottom: 53.6,51.7 54.1,51.7 54.1,51.3 53.6,51.3
SWCLK
  Bottom 0.2: U$1.PA14 48.85,49.2 50.05,50.4 50.05,53.05 49.3,53.8 ST-LINK.2
SWDIO
  Bottom 0.2: U$1.PA13 46.44,42.75 46.23,42.95 46.23,56.91 ST-LINK.4
SWO
  Bottom 0.2: ST-LINK.6 51.45,60.71 51.45,46.5 51.85,46.1 U$1.PB3
TX
  Top 0.2: PIN_SOCKET2.2 31.86,57 18.88,57 10.84,48.95 TWE_LEFT.3
UART_RX  (via drill 0.35)
  Top 0.2: v50.7,48.4 42.39,48.4 PIN_SOCKET1.1
  Bottom 0.2: v50.7,48.4 50.65,48.35 50.65,46.5 50.35,46.2 U$1.PC11
UART_TX  (via drill 0.35)
  Top 0.2: v49.85,46.8 39.55,46.8 35.04,51.31 PIN_SOCKET2.1
  Bottom 0.2: U$1.PC10 v49.85,46.8

### Text on the board
tNames: UART_SKT | RESET | FB1 | T1
bNames: C5